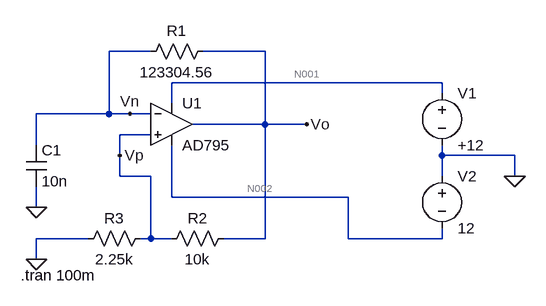
[diagram p0: schematic HomeworkProblem2.asc]
HomeworkProblem2.asc, the LTspice schematic file:
Version 4
SHEET 1 900 680
WIRE 320 64 256 64
WIRE 496 64 400 64
WIRE 768 112 352 112
WIRE 768 128 768 112
WIRE 352 144 352 112
WIRE 256 160 256 64
WIRE 256 160 144 160
WIRE 288 160 256 160
WIRE 320 160 288 160
WIRE 496 176 496 64
WIRE 496 176 384 176
WIRE 560 176 496 176
WIRE 320 192 272 192
WIRE 144 208 144 160
WIRE 272 224 272 192
WIRE 768 224 768 208
WIRE 880 224 768 224
WIRE 272 256 272 224
WIRE 320 256 272 256
WIRE 768 256 768 224
WIRE 880 256 880 224
WIRE 352 288 352 208
WIRE 624 288 352 288
WIRE 144 304 144 272
WIRE 224 352 144 352
WIRE 320 352 320 256
WIRE 320 352 304 352
WIRE 352 352 320 352
WIRE 496 352 496 176
WIRE 496 352 432 352
WIRE 624 352 624 288
WIRE 768 352 768 336
WIRE 768 352 624 352
WIRE 144 384 144 352
FLAG 144 304 0
FLAG 144 384 0
FLAG 560 176 Vo
FLAG 880 256 0
FLAG 272 224 Vp
FLAG 288 160 Vn
SYMBOL OpAmps\\AD795 352 112 R0
SYMATTR InstName U1
SYMBOL cap 128 208 R0
SYMATTR InstName C1
SYMATTR Value 10n
SYMBOL res 320 336 R90
WINDOW 0 0 56 VBottom 2
WINDOW 3 32 56 VTop 2
SYMATTR InstName R3
SYMATTR Value 2.25k
SYMBOL res 448 336 R90
WINDOW 0 0 56 VBottom 2
WINDOW 3 32 56 VTop 2
SYMATTR InstName R2
SYMATTR Value 10k
SYMBOL res 416 48 R90
WINDOW 0 0 56 VBottom 2
WINDOW 3 32 56 VTop 2
SYMATTR InstName R1
SYMATTR Value 123304.56
SYMBOL voltage 768 112 R0
WINDOW 123 0 0 Left 0
WINDOW 39 0 0 Left 0
SYMATTR InstName V1
SYMATTR Value +12
SYMBOL voltage 768 240 R0
WINDOW 123 0 0 Left 0
WINDOW 39 0 0 Left 0
SYMATTR InstName V2
SYMATTR Value 12
TEXT 120 408 Left 2 !.tran 100m

The netlist it stands for:
* HomeworkProblem2.asc
XU1 Vp Vn N001 N002 Vo AD795  ; pins In+ In- V+ V- OUT
C1 Vn 0 10n
R3 Vp 0 2.25k
R2 Vo Vp 10k
R1 Vo Vn 123304.56
V1 N001 0 +12
V2 0 N002 12
.tran 100m
.lib ADI1.lib
.backanno
.end

* Results of the author's LTspice run, read from the files saved beside the schematic
* Operating Point, zero values left out:
*   V(n001) = 12 V
*   V(n002) = -12 V
*   I(V1) = -1.226 mA
*   I(V2) = -1.226 mA
*   Ix(u1:3) = 1.226 mA
*   Ix(u1:4) = -1.226 mA
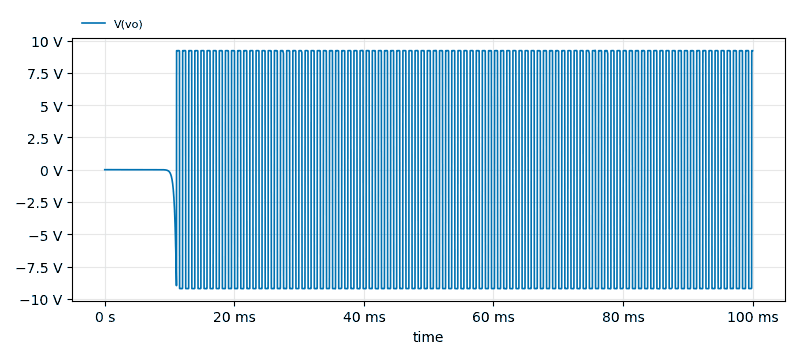
[diagram p1: Transient Analysis of HomeworkProblem2.asc, plotted from the saved traces]
* Transient Analysis, 1 run:
*   V(vo): min -9.225 V, max 9.238 V, average -5.02 mV, rms 8.613 V, last 9.215 V